# EAGLE design SparkFun_SSOP16_Breakout_v10 (EAGLE 6.5.0)
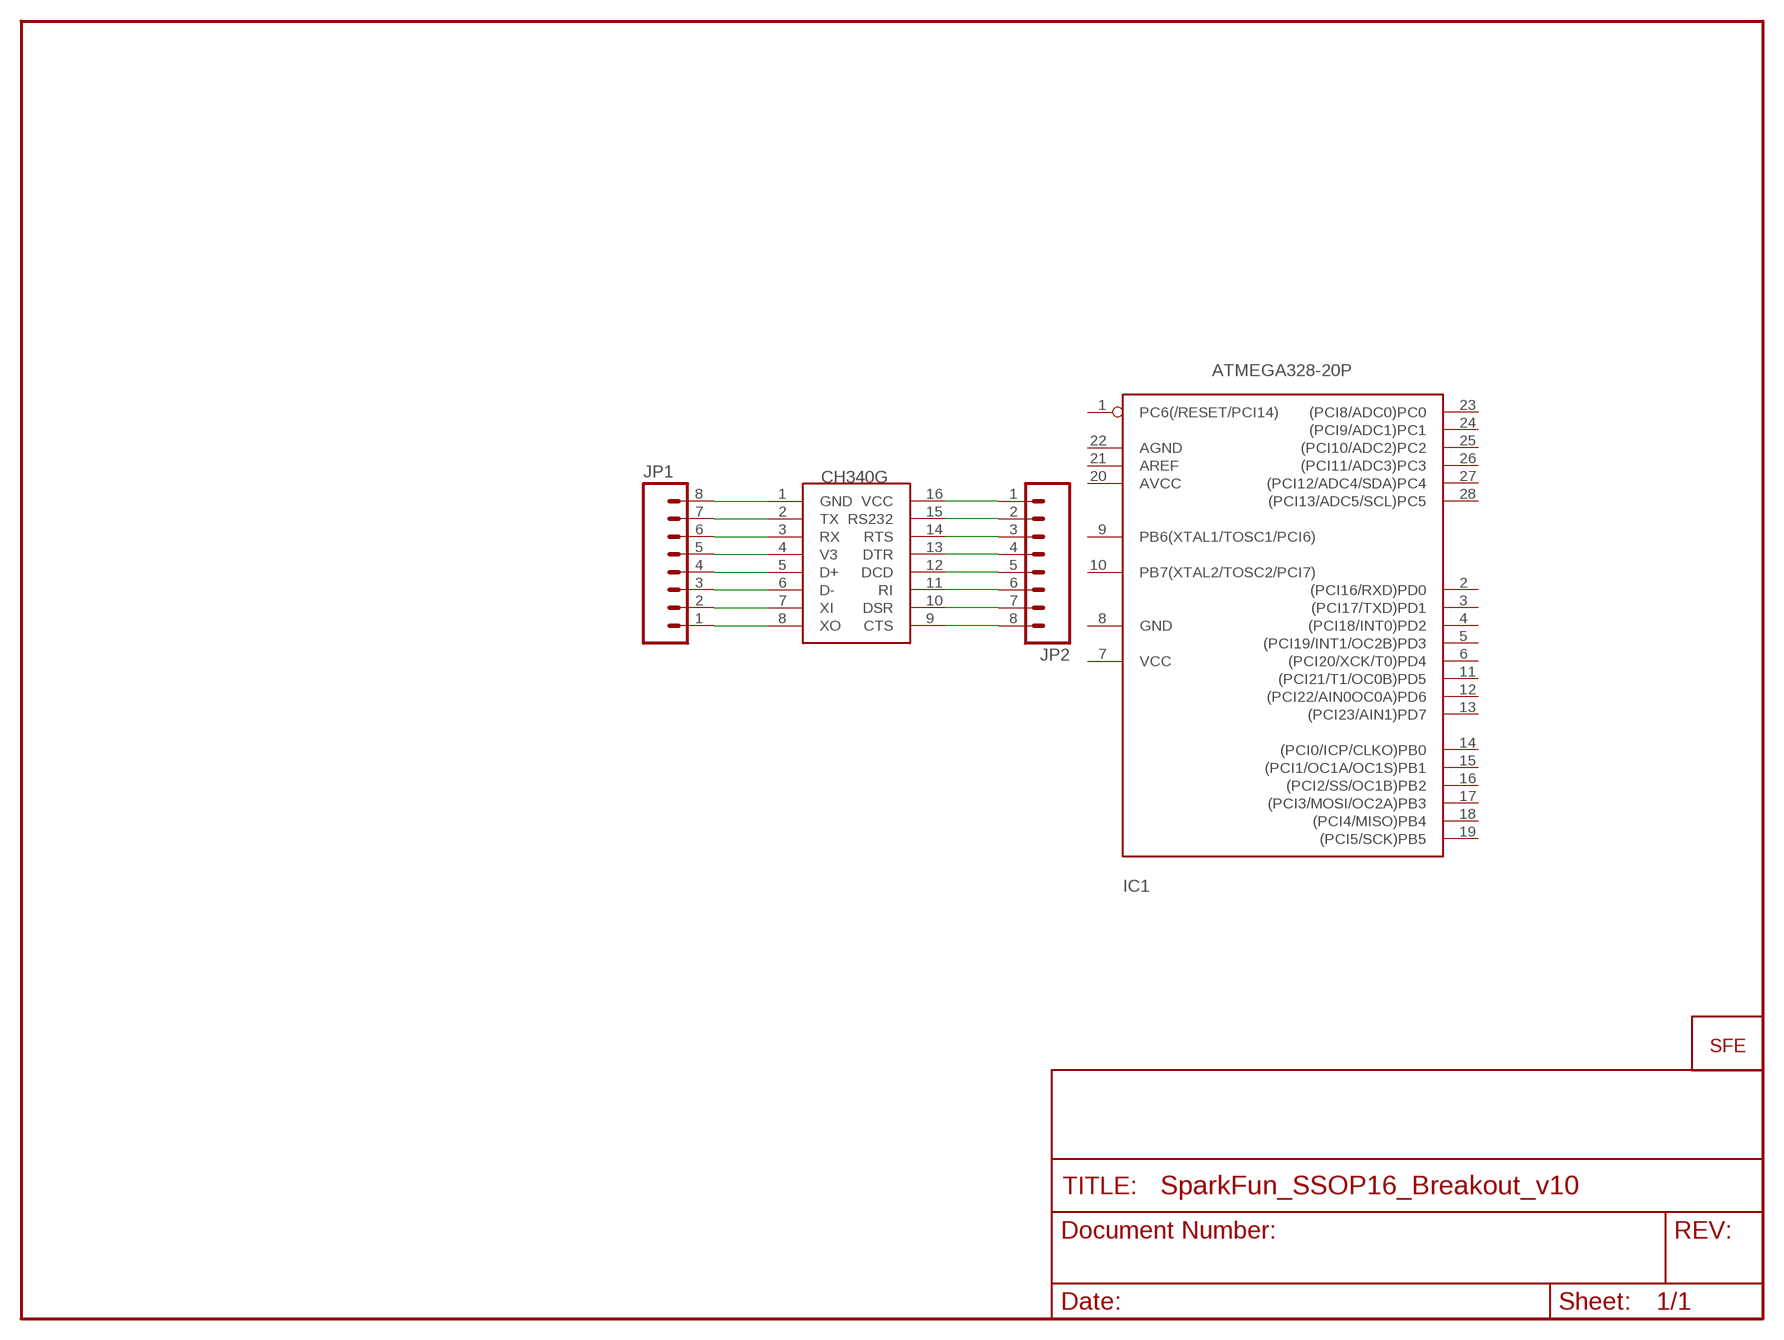
[diagram p0: schematic, sheet 1]

## Parts
IC1  ATMEGA328-20P  [DIL28-3]
JP1  M08  [1X08]
JP2  M08  [1X08]
U$1  LOGO-SFESK  [SFE-LOGO-FLAME]
U$2  CH340G  [SOIC16]

## Nets
N$1: JP1.1 U$2.8(XO)
N$2: JP1.2 U$2.7(XI)
N$3: JP1.3 U$2.6(D-)
N$4: JP1.4 U$2.5(D+)
N$5: JP1.5 U$2.4(V3)
N$6: JP1.6 U$2.3(RX)
N$7: JP1.7 U$2.2(TX)
N$8: JP1.8 U$2.1(GND)
N$9: JP2.1 U$2.16(VCC)
N$10: JP2.2 U$2.15(RS232)
N$11: JP2.3 U$2.14(RTS)
N$12: JP2.4 U$2.13(DTR)
N$13: JP2.5 U$2.12(DCD)
N$14: JP2.6 U$2.11(RI)
N$15: JP2.7 U$2.10(DSR)
N$16: JP2.8 U$2.9(CTS)
Unconnected: IC1.1(PC6(/RESET/PCI14)) IC1.2((PCI16/RXD)PD0) IC1.3((PCI17/TXD)PD1) IC1.4((PCI18/INT0)PD2) IC1.5((PCI19/INT1/OC2B)PD3) IC1.6((PCI20/XCK/T0)PD4) IC1.7(VCC) IC1.8(GND) IC1.9(PB6(XTAL1/TOSC1/PCI6)) IC1.10(PB7(XTAL2/TOSC2/PCI7)) IC1.11((PCI21/T1/OC0B)PD5) IC1.12((PCI22/AIN0OC0A)PD6) IC1.13((PCI23/AIN1)PD7) IC1.14((PCI0/ICP/CLKO)PB0) IC1.15((PCI1/OC1A/OC1S)PB1) IC1.16((PCI2/SS/OC1B)PB2) IC1.17((PCI3/MOSI/OC2A)PB3) IC1.18((PCI4/MISO)PB4) IC1.19((PCI5/SCK)PB5) IC1.20(AVCC) IC1.21(AREF) IC1.22(AGND) IC1.23((PCI8/ADC0)PC0) IC1.24((PCI9/ADC1)PC1) IC1.25((PCI10/ADC2)PC2) IC1.26((PCI11/ADC3)PC3) IC1.27((PCI12/ADC4/SDA)PC4) IC1.28((PCI13/ADC5/SCL)PC5)

## Library data of the parts
IC1 = atmega328:ATMEGA328*P: MICROCONTROLLER 32 kBytes FLASH 2 kBytes SRAM 1 kBytes EEPROM USART 8-channel 10 bit ADC
JP1 JP2 = SparkFun:M08: Header 8 Standard 8-pin 0.1" header. Use with straight break away headers (SKU : PRT-00116), right angle break away headers (PRT-00553), swiss pins (PRT-00743), machine pins (PRT-00117), and female headers (PRT-00115).
U$1 = SparkFun:LOGO-SFE: Spark Fun Electronics PCB Logo This is the standard Spark Fun Electronics PCB logo.
U$2 = ch340g:CH340G

## Board
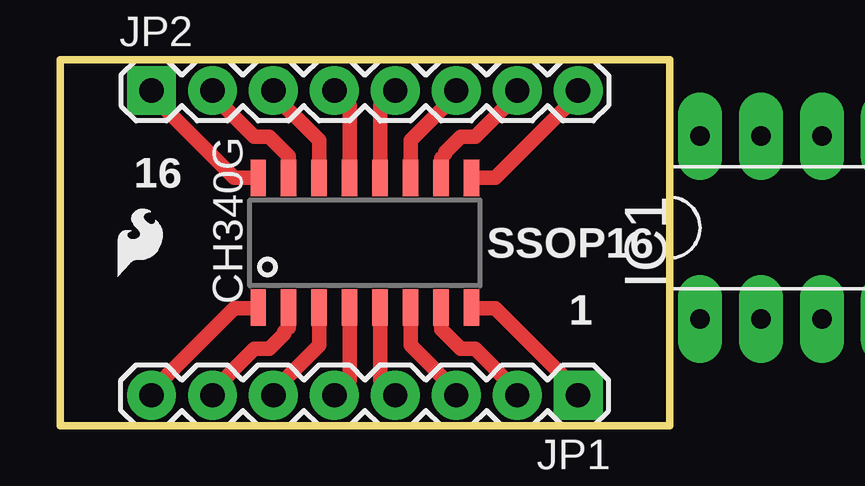
[diagram p1: board, top side]

Size 25.4 x 15.24 mm. Coordinates in mm from the lower left corner, seen from the top.
Outline: 0,0 25.4,0 25.4,15.24 0,15.24 0,0
Copper layers (1*16): Top 0.035mm / dielectric 1.5mm / Bottom 0.035mm
Design rules "SparkFun *": minimum track width 0.6mm, minimum drill 0.6mm, track to track 0.6mm, track to pad 0.6mm, pad to pad 0.6mm, via to via 0.6mm, smd to smd 0.6mm, copper to edge 0.6mm, drill to drill 0.6mm, minimum pad ring 0.6mm, minimum via ring 10mil, stop-mask expansion 0.6mm, vias tented up to drill 25mil, thermal gap 10mil

### Footprints (pad centres in the part's own frame; a part is rotated, then mirrored left to right if it is on the bottom)
DIL28-3 = drill 0.813 long: 1 -16.51,-3.81; 2 -13.97,-3.81; 3 -11.43,-3.81; 4 -8.89,-3.81; 5 -6.35,-3.81; 6 -3.81,-3.81; 7 -1.27,-3.81; 8 1.27,-3.81; 9 3.81,-3.81; 10 6.35,-3.81; 11 8.89,-3.81; 12 11.43,-3.81; 13 13.97,-3.81; 14 16.51,-3.81; 15 16.51,3.81; 16 13.97,3.81; 17 11.43,3.81; 18 8.89,3.81; 19 6.35,3.81; 20 3.81,3.81; 21 1.27,3.81; 22 -1.27,3.81; 23 -3.81,3.81; 24 -6.35,3.81; 25 -8.89,3.81; 26 -11.43,3.81; 27 -13.97,3.81; 28 -16.51,3.81
1X08 = drill 1.016 pad 1.829 square: 1 0,0 | drill 1.016 pad 1.829: 2 2.54,0; 3 5.08,0; 4 7.62,0; 5 10.16,0; 6 12.7,0; 7 15.24,0; 8 17.78,0
SOIC16 = smd 0.635 x 1.524: 1 -4.445,-2.695; 2 -3.175,-2.695; 3 -1.905,-2.695; 4 -0.635,-2.695; 5 0.635,-2.695; 6 1.905,-2.695; 7 3.175,-2.695; 8 4.445,-2.695; 9 4.445,2.695; 10 3.175,2.695; 11 1.905,2.695; 12 0.635,2.695; 13 -0.635,2.695; 14 -1.905,2.695; 15 -3.175,2.695; 16 -4.445,2.695

### Placement (x,y rotation side)
IC1  43.18,8.26 0 top
JP1  21.59,1.27 180 top
JP2  3.81,13.97 0 top
U$1  2.41,6.22 0 top
U$2  12.7,7.62 0 top

### Tracks (layer width: path | path; a pad name or v marks a point on that pad's centre or on a via)
N$1
  Top 0.6: JP1.1 21.59,1.45 18.14,4.9 17.14,4.9 U$2.8
N$2
  Top 0.6: U$2.7 15.88,4.01 16.69,3.2 17.3,3.2 19.05,1.45 JP1.2
N$3
  Top 0.6: U$2.6 14.61,3.35 16.51,1.45 JP1.3
N$4
  Top 0.6: U$2.5 13.34,1.91 JP1.4
N$5
  Top 0.6: U$2.4 12.06,1.91 JP1.5
N$6
  Top 0.6: U$2.3 10.79,3.35 8.89,1.45 JP1.6
N$7
  Top 0.6: U$2.2 9.53,4.09 9.35,3.91 9.35,3.83 8.71,3.2 8.1,3.2 6.35,1.45 JP1.7
N$8
  Top 0.6: JP1.8 3.81,1.45 7.26,4.9 8.26,4.9 U$2.1
N$9
  Top 0.6: JP2.1 3.81,13.79 7.26,10.34 8.26,10.34 U$2.16
N$10
  Top 0.6: U$2.15 9.53,11.23 8.71,12.04 8.1,12.04 6.35,13.79 JP2.2
N$11
  Top 0.6: U$2.14 10.79,11.89 8.89,13.79 JP2.3
N$12
  Top 0.6: U$2.13 12.06,13.33 JP2.4
N$13
  Top 0.6: U$2.12 13.34,13.33 JP2.5
N$14
  Top 0.6: U$2.11 14.61,11.89 16.51,13.79 JP2.6
N$15
  Top 0.6: U$2.10 15.88,11.15 16.05,11.33 16.05,11.4 16.69,12.04 17.3,12.04 19.05,13.79 JP2.7
N$16
  Top 0.6: JP2.8 21.59,13.79 18.14,10.34 17.14,10.34 U$2.9

### Text on the board
tPlace: 16 | SSOP16 | 1